# Altium schematic sheet Transfer.SchDoc
size A4
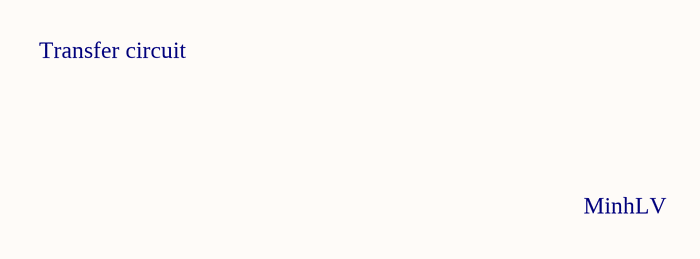
[diagram p0: Transfer.SchDoc]

## Notes on the sheet
- Transfer circuit
- MinhLV